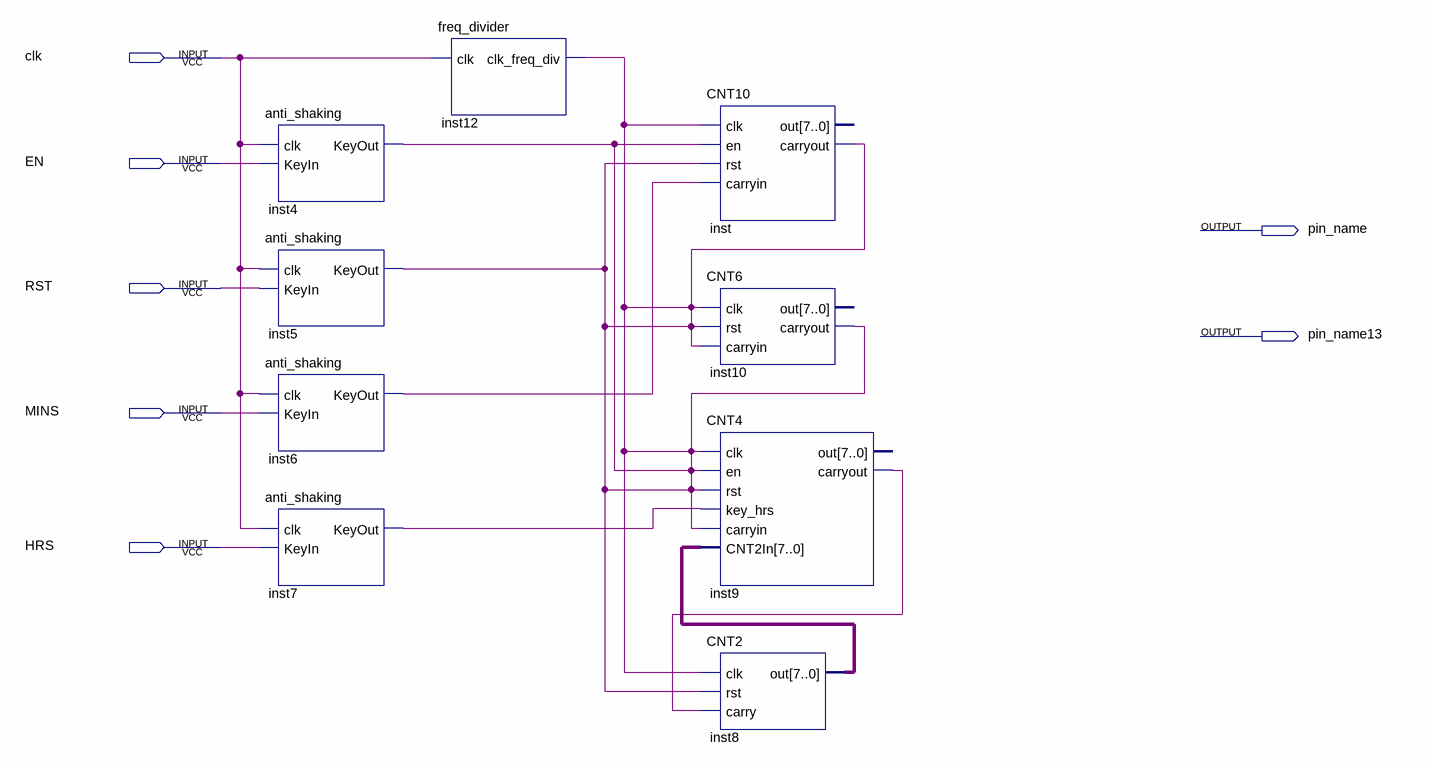
[diagram p0: schematic sheet]
// Quartus schematic Digital_clock.bdf as structural Verilog: 9 symbols, 7 pins
module Digital_clock (
  input  clk,
  input  EN,
  input  RST,
  input  MINS,
  input  HRS,
  output pin_name,
  output pin_name13
);

  wire inst4_keyout, inst6_keyout, inst7_keyout, inst9_carryout;
  wire [7:0] inst8_out;

  anti_shaking inst4 (.clk(clk), .KeyIn(EN), .KeyOut(inst4_keyout));
  anti_shaking inst5 (.clk(clk), .KeyIn(RST), .KeyOut(inst4_keyout));
  anti_shaking inst6 (.clk(clk), .KeyIn(MINS), .KeyOut(inst6_keyout));
  anti_shaking inst7 (.clk(clk), .KeyIn(HRS), .KeyOut(inst7_keyout));
  freq_divider inst12 (.clk(clk), .clk_freq_div(inst4_keyout));
  CNT10 inst (
    .clk(inst4_keyout), .en(inst4_keyout), .rst(inst4_keyout), .carryin(inst6_keyout), .carryout(inst4_keyout));  // open: out
  CNT6 inst10 (.clk(inst4_keyout), .rst(inst4_keyout), .carryin(inst4_keyout), .carryout(inst4_keyout));  // open: out
  CNT4 inst9 (
    .clk(inst4_keyout), .en(inst4_keyout), .rst(inst4_keyout), .key_hrs(inst7_keyout),
    .carryin(inst4_keyout), .CNT2In(inst8_out), .carryout(inst9_carryout));  // open: out
  CNT2 inst8 (.clk(inst4_keyout), .rst(inst4_keyout), .carry(inst9_carryout), .out(inst8_out));
endmodule
